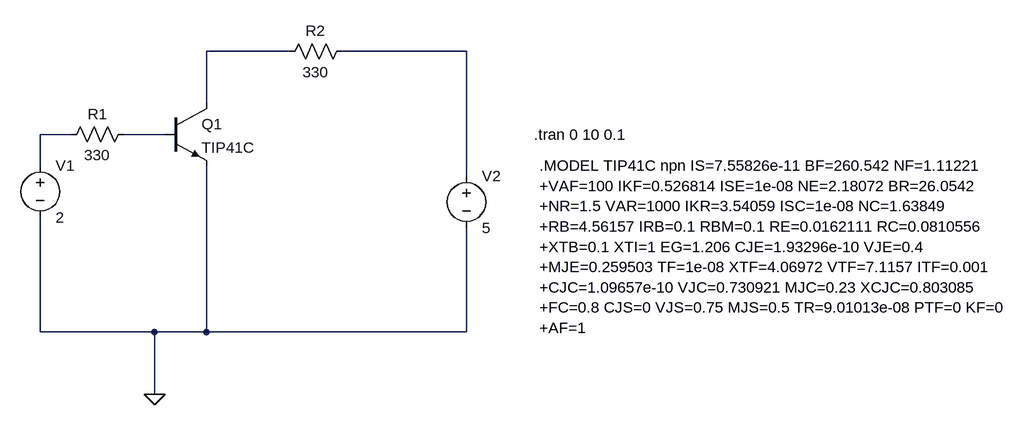
[diagram p0: schematic Draft11.asc]
Draft11.asc, the LTspice schematic file:
Version 4
SHEET 1 1372 680
WIRE 272 64 144 64
WIRE 544 64 352 64
WIRE 144 144 144 64
WIRE -64 192 -112 192
WIRE 80 192 16 192
WIRE -112 240 -112 192
WIRE 544 256 544 64
WIRE -112 496 -112 320
WIRE 64 496 -112 496
WIRE 144 496 144 240
WIRE 144 496 64 496
WIRE 544 496 544 336
WIRE 544 496 144 496
WIRE 64 592 64 496
FLAG 64 592 0
SYMBOL npn 80 144 R0
SYMATTR InstName Q1
SYMATTR Value TIP41C
SYMBOL voltage -112 224 R0
SYMATTR InstName V1
SYMATTR Value 2
SYMBOL voltage 544 240 R0
SYMATTR InstName V2
SYMATTR Value 5
SYMBOL res 32 176 R90
WINDOW 0 0 56 VBottom 2
WINDOW 3 32 56 VTop 2
SYMATTR InstName R1
SYMATTR Value 330
SYMBOL res 368 48 R90
WINDOW 0 0 56 VBottom 2
WINDOW 3 32 56 VTop 2
SYMATTR InstName R2
SYMATTR Value 330
TEXT 656 240 Left 2 !.MODEL TIP41C npn IS=7.55826e-11 BF=260.542 NF=1.11221\n+VAF=100 IKF=0.526814 ISE=1e-08 NE=2.18072 BR=26.0542\n+NR=1.5 VAR=1000 IKR=3.54059 ISC=1e-08 NC=1.63849\n+RB=4.56157 IRB=0.1 RBM=0.1 RE=0.0162111 RC=0.0810556\n+XTB=0.1 XTI=1 EG=1.206 CJE=1.93296e-10 VJE=0.4\n+MJE=0.259503 TF=1e-08 XTF=4.06972 VTF=7.1157 ITF=0.001\n+CJC=1.09657e-10 VJC=0.730921 MJC=0.23 XCJC=0.803085\n+FC=0.8 CJS=0 VJS=0.75 MJS=0.5 TR=9.01013e-08 PTF=0 KF=0\n+AF=1
TEXT 648 192 Left 2 !.tran 0 10 0.1

The netlist it stands for:
* Draft11.asc
Q1 N001 N004 0 0 TIP41C
V1 N003 0 2
V2 N002 0 5
R1 N004 N003 330
R2 N002 N001 330
.model NPN NPN
.model PNP PNP
.lib standard.bjt
.MODEL TIP41C npn IS=7.55826e-11 BF=260.542 NF=1.11221
+VAF=100 IKF=0.526814 ISE=1e-08 NE=2.18072 BR=26.0542
+NR=1.5 VAR=1000 IKR=3.54059 ISC=1e-08 NC=1.63849
+RB=4.56157 IRB=0.1 RBM=0.1 RE=0.0162111 RC=0.0810556
+XTB=0.1 XTI=1 EG=1.206 CJE=1.93296e-10 VJE=0.4
+MJE=0.259503 TF=1e-08 XTF=4.06972 VTF=7.1157 ITF=0.001
+CJC=1.09657e-10 VJC=0.730921 MJC=0.23 XCJC=0.803085
+FC=0.8 CJS=0 VJS=0.75 MJS=0.5 TR=9.01013e-08 PTF=0 KF=0
+AF=1
.tran 0 10 0.1
.backanno
.end